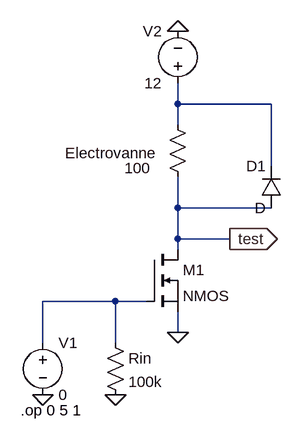
[diagram p0: schematic ActionneurElectrovanne.asc]
ActionneurElectrovanne.asc, the LTspice schematic file:
Version 4
SHEET 1 880 680
WIRE -144 -128 -144 -160
WIRE 0 -128 -144 -128
WIRE -144 -96 -144 -128
WIRE 0 -32 0 -128
WIRE -144 32 -144 -16
WIRE 0 32 -144 32
WIRE -144 80 -144 32
WIRE -64 80 -144 80
WIRE -144 96 -144 80
WIRE -240 176 -352 176
WIRE -192 176 -240 176
WIRE -144 224 -144 192
WIRE -352 240 -352 176
WIRE -240 240 -240 176
FLAG -352 320 0
FLAG -144 224 0
FLAG -240 320 0
FLAG -144 -240 0
FLAG -64 80 test
IOPIN -64 80 Out
SYMBOL voltage -352 224 R0
WINDOW 123 0 0 Left 0
WINDOW 39 0 0 Left 0
SYMATTR InstName V1
SYMATTR Value 0
SYMBOL res -256 224 R0
SYMATTR InstName Rin
SYMATTR Value 100k
SYMBOL voltage -144 -144 R180
WINDOW 0 24 96 Left 2
WINDOW 3 24 16 Left 2
SYMATTR InstName V2
SYMATTR Value 12
SYMBOL res -160 -112 R0
WINDOW 0 -158 60 Left 2
WINDOW 3 -66 83 Left 2
SYMATTR InstName Electrovanne
SYMATTR Value 100
SYMBOL nmos -192 96 R0
SYMATTR InstName M1
SYMBOL diode 16 32 R180
WINDOW 0 24 64 Left 2
WINDOW 3 24 0 Left 2
SYMATTR InstName D1
TEXT -386 344 Left 2 !.op 0 5 1

The netlist it stands for:
* ActionneurElectrovanne.asc
V1 N002 0 0
Rin N002 0 100k
V2 N001 0 12
R§Electrovanne N001 test 100
M1 test N002 0 0 NMOS
D1 test N001 D
.model D D
.lib standard.dio
.model NMOS NMOS
.model PMOS PMOS
.lib standard.mos
.op 0 5 1
.backanno
.end